# EAGLE design gsm_LoRa_due (EAGLE 9.6.2)
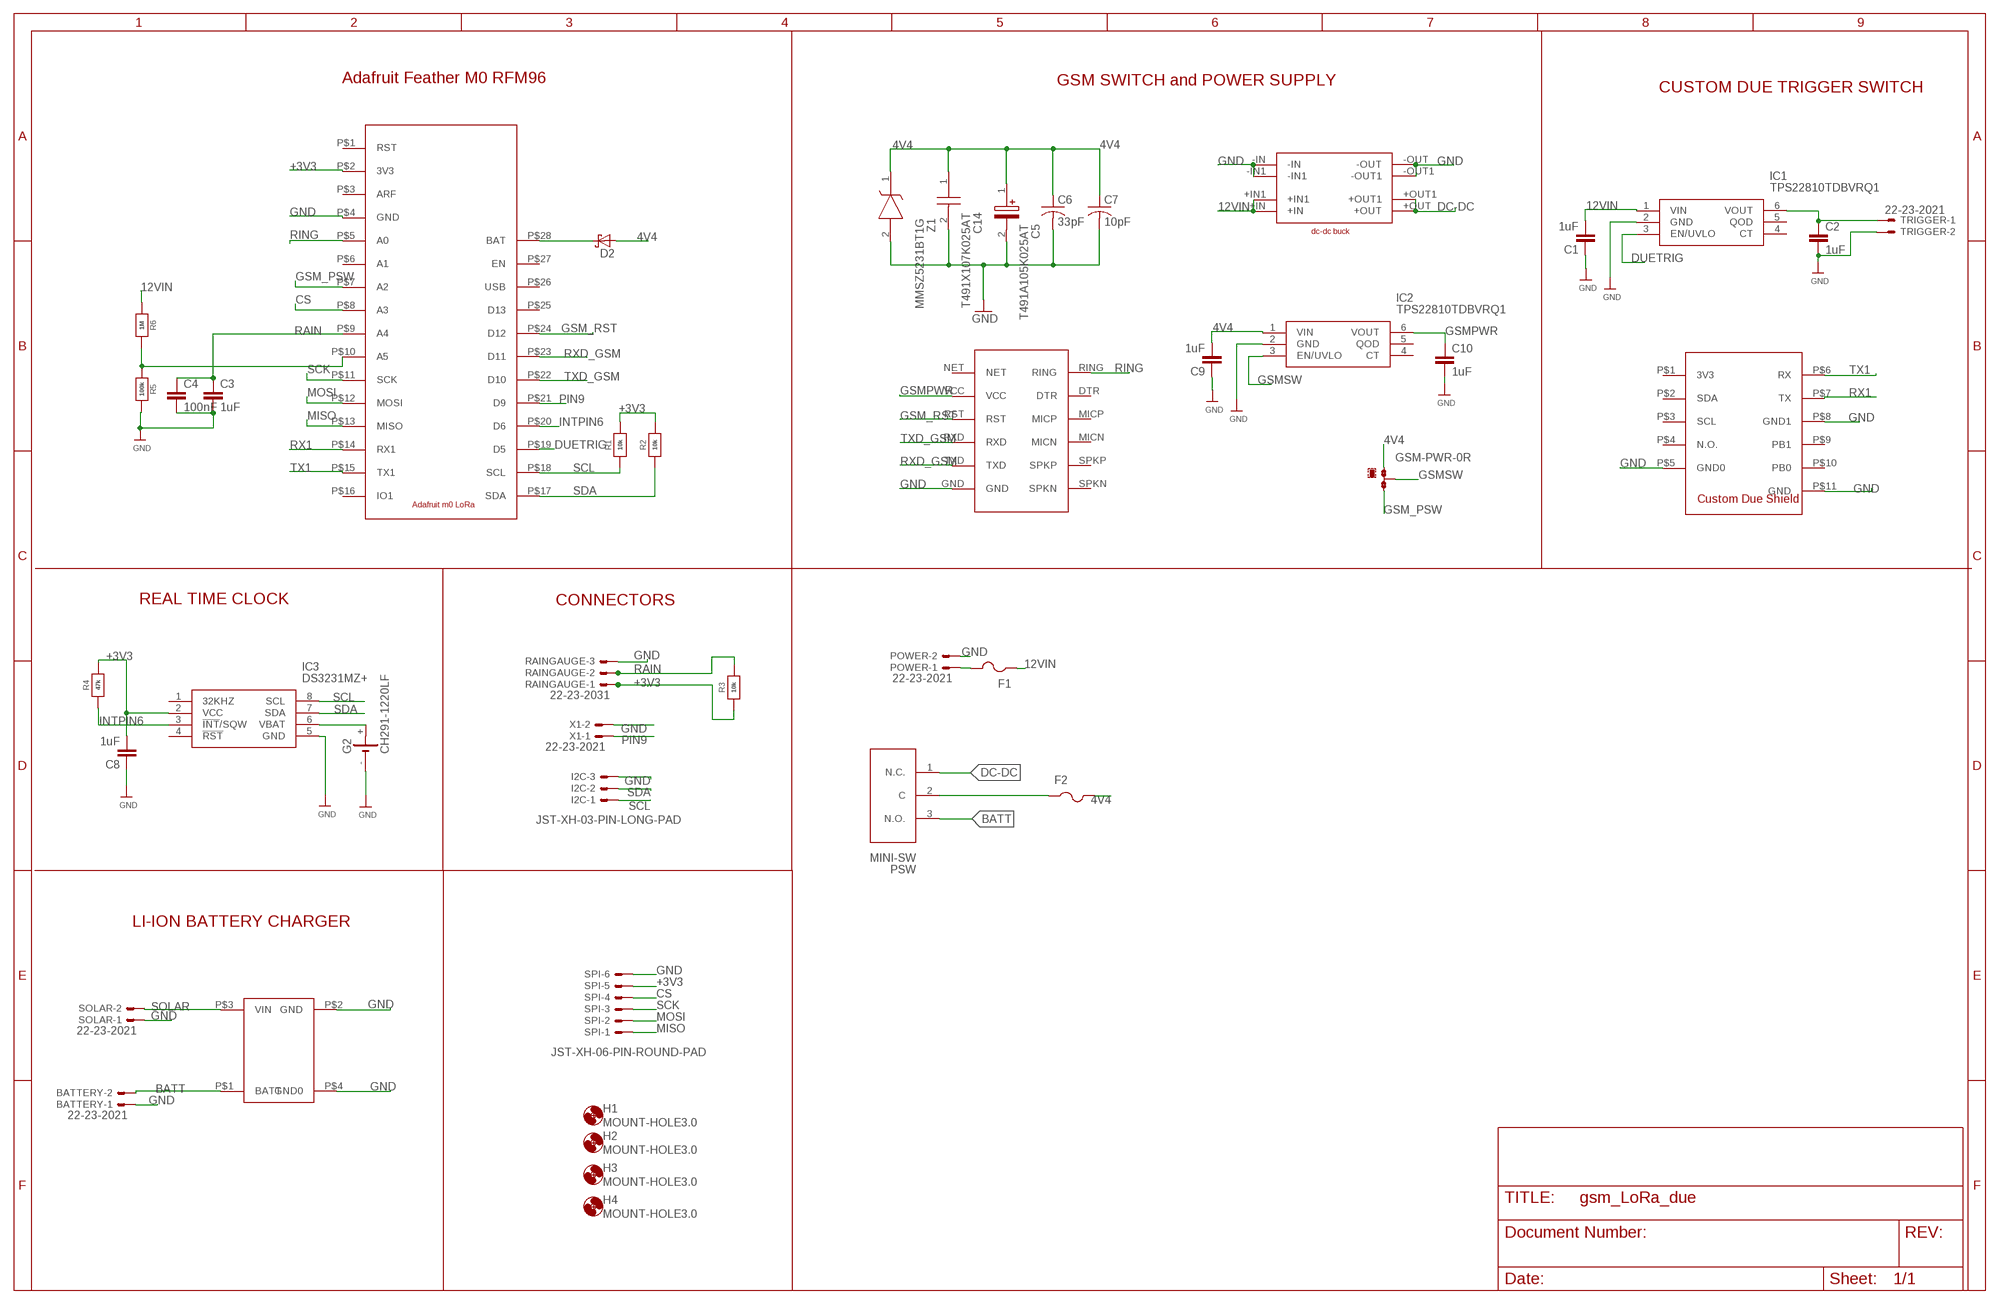
[diagram p0: schematic, sheet 1]

## Parts
BATTERY  22-23-2021  [22-23-2021]
C1  1uF  CC0603  [C0603]
C2  1uF  CC0603  [C0603]
C3  1uF  CC0603  [C0603]
C4  100nF  CC0603  [C0603]
C5  T491A105K025AT  [CAPPM3216X180N]
C6  33pF  C-USC0603  [C0603]
C7  10pF  C-USC0603  [C0603]
C8  1uF  CC0603  [C0603]
C9  1uF  CC0603  [C0603]
C10  1uF  CC0603  [C0603]
C14  T491X107K025AT  [CAPPM7343X430N]
D2  SCHOTTKY-DIODE  [DIODE_SMB]
F1  PTCFUSE-1206  [R1206]
F2  PTCFUSE-1206  [R1206]
G2  CH291-1220LF  [CH291-1220LF]
GSM-PWR  0R-JUMPB  [B0R-JMP]
H1  MOUNT-HOLE3.0  [3,0]
H2  MOUNT-HOLE3.0  [3,0]
H3  MOUNT-HOLE3.0  [3,0]
H4  MOUNT-HOLE3.0  [3,0]
I2C  JST-XH-03-PIN-LONG-PAD  [JST-XH-03-PACKAGE-LONG-PAD]
IC1  TPS22810TDBVRQ1  [SOT95P280X145-6N]
IC2  TPS22810TDBVRQ1  [SOT95P280X145-6N]
IC3  DS3231MZ+  [SOIC127P600X175-8N]
POWER  22-23-2021  [22-23-2021]
PSW  MINI-SW  [MINI-SW]
R1  10k  RESISTOR_0603_NOOUT  [0603-NO]
R2  10k  RESISTOR_0603_NOOUT  [0603-NO]
R3  10k  RESISTOR_0603_NOOUT  [0603-NO]
R4  47k  RESISTOR_0603_NOOUT  [0603-NO]
R5  100k  RESISTOR_0603_NOOUT  [0603-NO]
R6  1M  RESISTOR_0603_NOOUT  [0603-NO]
RAINGAUGE  22-23-2031  [22-23-2031]
SOLAR  22-23-2021  [22-23-2021]
SPI  JST-XH-06-PIN-ROUND-PAD  [JST-XH-06-PACKAGE-ROUND-PAD]
TRIGGER  22-23-2021  [22-23-2021]
U$1  M0_LORA  [RFM69]
U$8  DUE_PADSDUE_GSM  [DUESHIELD_BIG]
U$9  SIM800L_MODULE  [SIM800L]
U$10  DC-DC_BUCK_MAD  [DC-DC_BUCK]
U$11  LI-ION-CHARGER  [LI-ION]
X1  22-23-2021  [22-23-2021]
Z1  MMSZ5231BT1G  [SOD3716X135N]

## Nets
4V4: C5.1(+) C6.1 C7.1 C9.2 C14.1 D2.A(C) F2.2 GSM-PWR.1 IC2.1(VIN) Z1.1(K)
12VIN: C1.2 F1.1 IC1.1(VIN) R6.1 U$10.+IN U$10.+IN1
+3V3: C8.2 IC3.2(VCC) R1.2 R2.2 R3.1 R4.2 RAINGAUGE.1 SPI.5 U$1.P$2(3V3)
BATT: BATTERY.2 PSW.3(N.O.) U$11.P$1(BATT)
CS: SPI.4 U$1.P$8(A3)
DC-DC: PSW.1(N.C.) U$10.+OUT U$10.+OUT1
DUETRIG: IC1.3(EN/UVLO) U$1.P$19(D5)
GND: BATTERY.1 C1.1 C2.2 C3.2 C4.2 C5.2(-) C6.2 C7.2 C8.1 C9.1 C10.2 C14.2 G2.- I2C.3 IC1.2(GND) IC2.2(GND) IC3.5(GND) POWER.2 R5.2 RAINGAUGE.3 SOLAR.1 SPI.6 TRIGGER.2 U$1.P$4(GND) U$8.P$5(GND0) U$8.P$8(GND1) U$8.P$11(GND) U$9.GND U$10.-IN U$10.-IN1 U$10.-OUT U$10.-OUT1 U$11.P$2(GND) U$11.P$4(GND0) X1.2 Z1.2(A)
GSM_PSW: GSM-PWR.3 U$1.P$7(A2)
GSM_RST: U$1.P$24(D12) U$9.RST
GSMPWR: C10.1 IC2.6(VOUT) U$9.VCC
GSMSW: GSM-PWR.2 IC2.3(EN/UVLO)
INTPIN6: IC3.3(!INT!/SQW) R4.1 U$1.P$20(D6)
MISO: SPI.1 U$1.P$13(MISO)
MOSI: SPI.2 U$1.P$12(MOSI)
N$1: D2.C(A) U$1.P$28(BAT)
N$2: G2.+ IC3.6(VBAT)
N$4: F1.2 POWER.1
N$5: R5.1 R6.2 U$1.P$10(A5)
N$6: F2.1 PSW.2(C)
N$8: C2.1 IC1.6(VOUT) TRIGGER.1
PIN9: U$1.P$21(D9) X1.1
RAIN: C3.1 C4.1 R3.2 RAINGAUGE.2 U$1.P$9(A4)
RING: U$1.P$5(A0) U$9.RING
RX1: U$1.P$14(RX1) U$8.P$7(TX)
RXD_GSM: U$1.P$23(D11) U$9.TXD
SCK: SPI.3 U$1.P$11(SCK)
SCL: I2C.1 IC3.8(SCL) R1.1 U$1.P$18(SCL)
SDA: I2C.2 IC3.7(SDA) R2.1 U$1.P$17(SDA)
SOLAR: SOLAR.2 U$11.P$3(VIN)
TX1: U$1.P$15(TX1) U$8.P$6(RX)
TXD_GSM: U$1.P$22(D10) U$9.RXD
Unconnected: IC1.4(CT) IC1.5(QOD) IC2.4(CT) IC2.5(QOD) IC3.1(32KHZ) IC3.4(!RST) U$1.P$1(RST) U$1.P$3(ARF) U$1.P$6(A1) U$1.P$16(IO1) U$1.P$25(D13) U$1.P$26(USB) U$1.P$27(EN) U$8.P$1(3V3) U$8.P$2(SDA) U$8.P$3(SCL) U$8.P$4(N.O.) U$8.P$9(PB1) U$8.P$10(PB0) U$9.DTR U$9.MICN U$9.MICP U$9.NET U$9.SPKN U$9.SPKP

## Notes on the sheet
- Adafruit Feather M0 RFM96 | GSM SWITCH and POWER SUPPLY
- CUSTOM DUE TRIGGER SWITCH
- REAL TIME CLOCK | CONNECTORS
- LI-ION BATTERY CHARGER

## Library data of the parts
BATTERY POWER SOLAR TRIGGER X1 = con-molex:22-23-2021: .100" (2.54mm) Center Header - 2 Pin; MF: MOLEX; MPN: 22-23-2021; OC_FARNELL: 1462926; OC_NEWARK: 25C3832
C1-C4 C8-C10 = eagle-ltspice:C: CAPACITOR, European symbol; SPICEMODEL: NONE; SPICEPREFIX: C
C5 = SamacSys_Parts:T491A105K025AT: Cap Tant Solid 1uF 25V A CASE 10% (3.2 X 1.6 X 1.6mm) SMD 3216-18 8 Ohm 125C Automotive T/R Source: Datasheet <http://uk.rs-online.com/web/p/products/8685769>; ALLIED_NUMBER: 70097127; DESCRIPTION: Cap Tant Solid 1uF 25V A CASE 10% (3.2 X 1.6 X 1.6mm) SMD 3216-18 8 Ohm 125C Automotive T/R; HEIGHT: 1.8mm; MANUFACTURER_NAME: Kemet; MANUFACTURER_PART_NUMBER: T491A105K025AT; RS_PART_NUMBER: 8685769; RS_PRICE-STOCK: http://uk.rs-online.com/web/p/products/8685769
C6 C7 = rcl:C-US: CAPACITOR, American symbol; SPICEPREFIX: C
C14 = T491X107K025AT:T491X107K025AT: Capacitor Tantalum T491 Case X 25V 100uF Kemet ??10% 100??F 25 V dc SMD Tantalum Electrolytic Capacitor, X ESR 300m?? +125??C T491 Source: Datasheet <http://uk.rs-online.com/web/p/products/8015511P>; DESCRIPTION: Capacitor Tantalum T491 Case X 25V 100uF Kemet ??10% 100??F 25 V dc SMD Tantalum Electrolytic Capacitor, X ESR 300m?? +125??C T491; HEIGHT: 4.3mm; MANUFACTURER_NAME: Kemet; MANUFACTURER_PART_NUMBER: T491X107K025AT; RS_PART_NUMBER: 8015511P; RS_PRICE-STOCK: http://uk.rs-online.com/web/p/products/8015511P
D2 = eagle-ltspice:SCHOTTKY-DIODE: Schottky Diode; SPICEMODEL: NONE; SPICEPREFIX: D; SPICETYPE: diode
F1 F2 = adafruit:PTCFUSE: PTC fuses, resettable thermistors
G2 = battery:CH291-1220LF: Battery Holder, SMT, 12mm multicomp PART NO. CH291-1220LF Source: Data sheet <http://www.farnell.com/datasheets/1505860.pdf>
GSM-PWR = jump-0r-smd:0R-JUMP: SMD 0R 0805 Jumper
H1-H4 = holes:MOUNT-HOLE: MOUNTING HOLE with drill center marker
I2C = Rembrandt Electronics - JST XH Connectors v1-0:JST-XH-03-PIN: JST XH Connector 2 Pin Wire to board connector. Pitch: 2,54 mm, (0.100") Number of pins: 3 Created by Rembrandt Electronics www.rembrandtelectronics.com
IC1 IC2 = TPS22810TDBVRQ1:TPS22810TDBVRQ1: Automotive 18V, 2A, 79m Load Switch With Adjustable Rise Time and Adjustable Quick Output Discharge Source: Datasheet <http://www.ti.com/lit/gpn/tps22810-q1>; DESCRIPTION: Automotive 18V, 2A, 79m Load Switch With Adjustable Rise Time and Adjustable Quick Output Discharge; HEIGHT: 1.45mm; MANUFACTURER_NAME: Texas Instruments; MANUFACTURER_PART_NUMBER: TPS22810TDBVRQ1
IC3 = DS3231MZ+:DS3231MZ+: Real Time Clock 5+/-ppm RTC Source: Datasheet <http://uk.rs-online.com/web/p/products/1897249>; DESCRIPTION: Real Time Clock 5+/-ppm RTC; HEIGHT: 1.75mm; MANUFACTURER_NAME: Maxim Integrated; MANUFACTURER_PART_NUMBER: DS3231MZ+; RS_PART_NUMBER: 1897249; RS_PRICE-STOCK: http://uk.rs-online.com/web/p/products/1897249
PSW = slide_switch:MINI-SW
R1-R6 = microbuilder:RESISTOR: Resistors For new designs, use the packages preceded by an '_' character since they are more reliable: The following footprints should be used on most boards: _0402 - Standard footprint for regular board layouts _0603 - Standard footprint for regular board layouts _0805 - Standard footprint for regular board layouts _1206 - Standard footprint for regular board layouts For extremely tight-pitch boards where space is at a premium, the following 'micro-pitch' footprints can be used (smaller pads, no silkscreen outline, etc.): _0402MP - Micro-pitch footprint for very dense/compact boards _0603MP - Micro-pitch footprint for very dense/compact boards _0805MP - Micro-pitch footprint for very dense/compact boards _1206MP - Micro-pitch footprint for very dense/compact boards
RAINGAUGE = con-molex:22-23-2031: .100" (2.54mm) Center Header - 3 Pin; MF: MOLEX; MPN: 22-23-2031; OC_FARNELL: 1462950; OC_NEWARK: 30C0862
SPI = Rembrandt Electronics - JST XH Connectors v1-0:JST-XH-06-PIN: JST XH Connector 2 Pin Wire to board connector. Pitch: 2,54 mm, (0.100") Number of pins: 6 Created by Rembrandt Electronics www.rembrandtelectronics.com
U$1 = m0_LoRa:M0_LORA
U$8 = due_shield_pad:DUE_PADS
U$9 = sim800L_module:SIM800L_MODULE
U$10 = dc-dc_mad:DC-DC_BUCK_MAD
U$11 = LI-ION-CHARGER:LI-ION-CHARGER
Z1 = SamacSys_Parts:MMSZ5231BT1G: 5.1V Zener diode,MMSZ5231B 500mW ON Semiconductor MMSZ5231BT1G Zener Diode, 5.1V 5% 0.5 W SMT 2-Pin SOD-123 Source: Datasheet <http://uk.rs-online.com/web/p/products/5453049P>; ALLIED_NUMBER: 70099546; DESCRIPTION: 5.1V Zener diode,MMSZ5231B 500mW ON Semiconductor MMSZ5231BT1G Zener Diode, 5.1V 5% 0.5 W SMT 2-Pin SOD-123; HEIGHT: 1.35mm; MANUFACTURER_NAME: ON Semiconductor; MANUFACTURER_PART_NUMBER: MMSZ5231BT1G; RS_PART_NUMBER: 5453049P

## Board
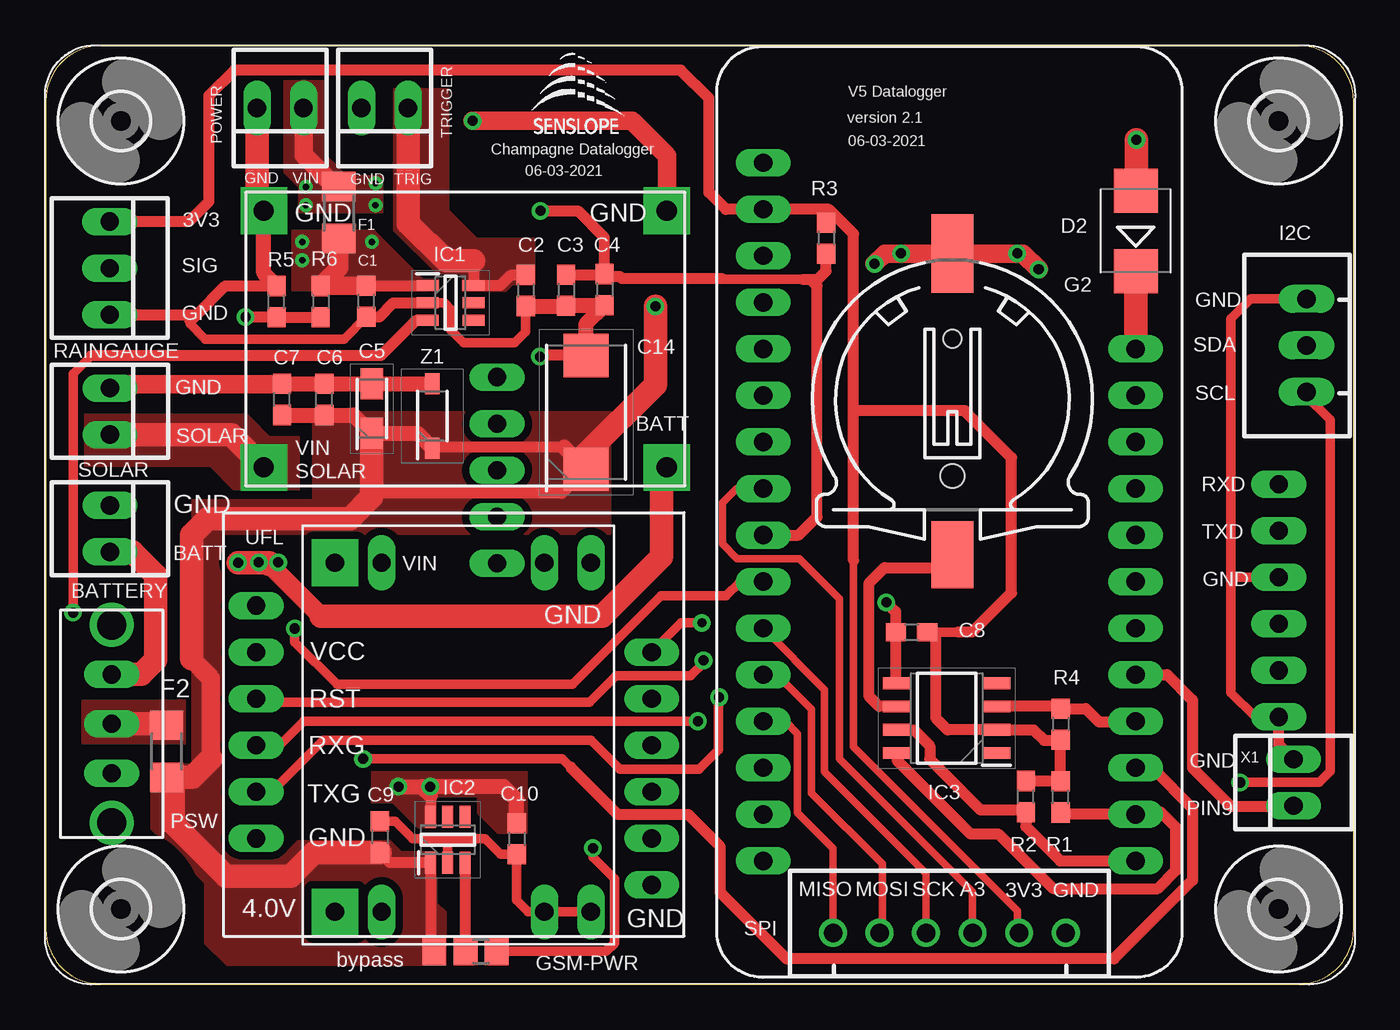
[diagram p1: board, top side]
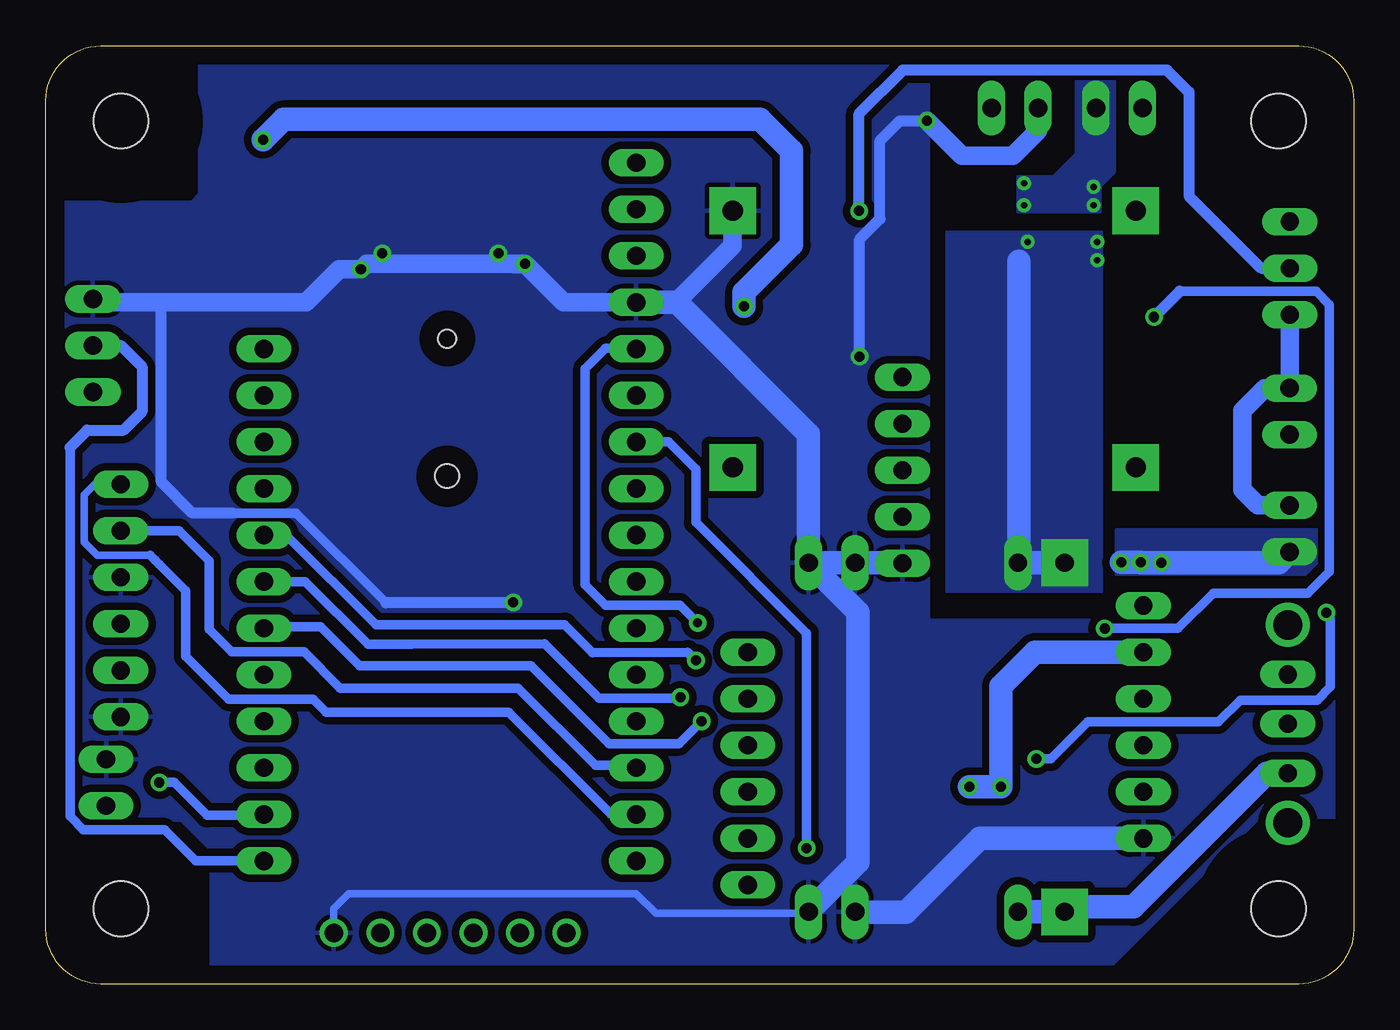
[diagram p2: board, bottom side, seen from below]

Size 71.4 x 51.2 mm. Coordinates in mm from the lower left corner, seen from the top.
Outline: 68.4,51.2 3,51.2 arc90 0,48.2 0,3 arc90 3,0 68.4,0 arc90 71.4,3 71.4,48.2 arc90 68.4,51.2
Copper layers (1*16): Top 0.035mm / dielectric 1.5mm / Bottom 0.035mm
Design rules "default": minimum track width 6mil, minimum drill 0.35mm, track to track 6mil, track to pad 6mil, pad to pad 6mil, via to via 6mil, smd to smd 6mil, copper to edge 40mil, drill to drill 6mil, minimum pad ring 10mil, minimum via ring 8mil, stop-mask expansion 4mil, vias tented up to drill 0mil, thermal gap 10mil

### Footprints (pad centres in the part's own frame; a part is rotated, then mirrored left to right if it is on the bottom)
22-23-2021 = drill 1 long: 1 -1.27,0; 2 1.27,0
C0603 = smd 1.1 x 1: 1 -0.85,0; 2 0.85,0
CAPPM3216X180N = smd 1.7 x 1.25: 1 -1.35,0; 2 1.35,0
CAPPM7343X430N = smd 2.35 x 2.45: 1 -3.1,0; 2 3.1,0
DIODE_SMB = smd 2.4 x 2.4: A 2.2,0; C -2.2,0
R1206 = smd 1.6 x 1.803: 1 -1.422,0; 2 1.422,0
CH291-1220LF = smd 2.3 x 3.66: + 0,-2.296 | smd 2.3 x 4.3: - 0,14.146 | hole 1.3: 0,2 | hole 1: 0,9.5
B0R-JMP = smd 1.5 x 1.3: 1 0,1.7; 2 0,0; 3 0,-1.7
3,0 = hole 3: 0,0
JST-XH-03-PACKAGE-LONG-PAD = drill 1.016 long: 1 -2.54,0; 2 0,0; 3 2.54,0
SOT95P280X145-6N = smd 1.2 x 0.6: 1 -1.25,0.95; 2 -1.25,0; 3 -1.25,-0.95; 4 1.25,-0.95; 5 1.25,0; 6 1.25,0.95
SOIC127P600X175-8N = smd 1.525 x 0.65: 1 -2.712,1.905; 2 -2.712,0.635; 3 -2.712,-0.635; 4 -2.712,-1.905; 5 2.712,-1.905; 6 2.712,-0.635; 7 2.712,0.635; 8 2.712,1.905
MINI-SW = drill 1 long: 1 0,0; 2 2.7,0; 3 5.4,0 | drill 1.6: 4 -2.7,0; 5 8.1,0
0603-NO = smd 1.1 x 1: 1 -0.85,0; 2 0.85,0
22-23-2031 = drill 1 long: 1 -2.54,0; 2 0,0; 3 2.54,0
JST-XH-06-PACKAGE-ROUND-PAD = drill 1.016: 1 -6.35,0; 2 -3.81,0; 3 -1.27,0; 4 1.27,0; 5 3.81,0; 6 6.35,0
RFM69 = drill 1 long: P$1 -10.16,21.59; P$2 -10.16,19.05; P$3 -10.16,16.51; P$4 -10.16,13.97; P$5 -10.16,11.43; P$6 -10.16,8.89; P$7 -10.16,6.35; P$8 -10.16,3.81; P$9 -10.16,1.27; P$10 -10.16,-1.27; P$11 -10.16,-3.81; P$12 -10.16,-6.35; P$13 -10.16,-8.89; P$14 -10.16,-11.43; P$15 -10.16,-13.97; P$16 -10.16,-16.51; P$17 10.16,-16.51; P$18 10.16,-13.97; P$19 10.16,-11.43; P$20 10.16,-8.89; P$21 10.16,-6.35; P$22 10.16,-3.81; P$23 10.16,-1.27; P$24 10.16,1.27; P$25 10.16,3.81; P$26 10.16,6.35; P$27 10.16,8.89; P$28 10.16,11.43
DUESHIELD_BIG = drill 1 long: P$1 -21.082,8.89; P$2 -21.082,6.35; P$3 -21.082,3.81; P$4 -21.082,1.27; P$5 -21.082,-1.27; P$6 21.59,3.048; P$7 21.59,0.508; P$8 21.59,-2.032; P$9 21.59,-4.572; P$10 21.59,-7.112; P$11 21.59,-9.652
SIM800L = drill 1 long: DTR 11.176,1.27; GND -10.414,-6.35; MICN 11.176,-3.81; MICP 11.176,-1.27; NET -10.414,6.35; RING 11.176,3.81; RST -10.414,1.27; RXD -10.414,-1.27; SPKN 11.176,-8.89; SPKP 11.176,-6.35; TXD -10.414,-3.81; VCC -10.414,3.81
DC-DC_BUCK = drill 1 pad 2.54 square: +IN 7.112,-8.89; +OUT 7.112,10.16 | drill 1 long: +IN1 4.572,-8.89; +OUT1 4.572,10.16; -IN -6.858,-8.89; -IN1 -4.318,-8.89; -OUT -6.858,10.16; -OUT1 -4.318,10.16
LI-ION = drill 1.1 pad 2.54 square: P$1 0,0; P$2 14,0; P$3 0,22; P$4 14,22
SOD3716X135N = smd 1.15 x 0.8: 1 -1.75,0; 2 1.75,0

### Placement (x,y rotation side)
BATTERY  3.5,24.85 270 top
C1  17.5,37.26 90 top
C2  26.2,37.85 270 top
C3  28.4,37.86 270 top
C4  30.5,37.9 270 top
C5  17.8,31.4 90 top
C6  15.2,31.9 90 top
C7  12.9,31.9 90 top
C8  47.27,19.2 0 top
C9  18.24,8.02 270 top
C10  25.7,7.92 270 top
C14  29.5,31.2 90 top
D2  59.5,41.1 90 top
F1  16,42.1 90 top
F2  6.6,12.7 270 top
G2  49.49,25.72 0 top
GSM-PWR  22.91,1.78 90 top
H1  67.3,4.1 0 top
H2  67.3,47.1 0 top
H3  4.1,4.1 0 top
H4  4.1,47.1 0 top
I2C  68.83,34.85 90 top
IC1  22.09,37.17 0 top
IC2  21.95,7.87 90 top
IC3  49.19,14.51 180 top
POWER  12.8,47.8 180 top
PSW  3.6,11.5 90 top
R1  55.4,10.21 90 top
R2  53.5,10.23 90 top
R3  42.6,40.7 270 top
R4  55.4,14.18 270 top
R5  12.6,37.24 90 top
R6  15,37.24 270 top
RAINGAUGE  3.49,39.07 270 top
SOLAR  3.5,31.25 270 top
SPI  49.33,2.79 0 top
TRIGGER  18.5,47.8 180 top
U$1  49.33,23.23 0 top
U$8  45.72,24.23 0 top
U$9  21.9,14.3 0 top
U$10  22.9,14.1 180 top
U$11  33.9,28.2 90 top
U$13  [LOGO_SML_TNAME]  28.83,48.02 0 top
X1  68.11,11 90 top
Z1  21.1,31 90 top

### Tracks (layer width: path | path; a pad name or v marks a point on that pad's centre or on a via)
4V4  (via drill 0.55)
  Top 0.61: Z1.1 21.15,29.3 28.3,29.3 | GSM-PWR.1 21,1.99 IC2.1 18.79,6.62 C9.2 | C14.1 28.17,26.77 17.98,26.77 17.8,26.59
  Top 0.813: 28.3,29.3 C14.1 | C7.1 C6.1 16.8,31.05 C5.1 20.3,30.05 Z1.1
  Top 1.016: 7.96,17.74 9,16.7 9,12.3
  Top 1.27: C5.1 17.8,26.59 16.61,25.4 8.84,25.4 7.96,24.52 7.96,17.74 | C14.1 29.5,28.94 33.27,32.71 v33.27,36.98 | v59.54,46.07 59.54,43.34 D2.A | C9.2 14.64,7.17 13.36,5.89 9.86,5.89 6.96,8.79 6.96,11.28 F2.2 7.98,11.28 9,12.3
  Bottom 1.27: v33.27,36.98 33.27,37.74 30.68,40.33 30.68,45.46 32.41,47.19 58.42,47.19 v59.54,46.07
  pour Top (isolate 0.406, no thermals): 21.34,7.21 21.34,4.42 21.84,3.91 21.84,1.01 9.91,1.01 8.69,2.23 8.69,5.54 5.74,8.48 5.74,12.01 7.99,12.01 7.99,26.41 14.53,26.41 14.58,26.47 14.58,31.24 30.84,31.24 30.84,24.53 9.64,24.53 9.64,7.63 10.46,6.81 12.75,6.81 13.77,7.82 18.8,7.82 19.41,7.21
12VIN  (via drill 0.35)
  Top 0.61: C1.2 IC1.1
  Top 1.016: C1.2 15.02,38.11 R6.1 16,39.09 F1.1
  Bottom 1.27: U$10.+IN U$10.+IN1 18.29,23.03 18.29,39.45 18.27,39.44
  other vias: 17.8,40.5 14,40.5 14,39.5
  pour Top (no thermals): 21.44,37.84 13.46,37.84 13.46,41.13 17.94,41.13 17.94,41.09 20.57,38.45 21.44,38.45
  pour Bottom (isolate 0.406, no thermals): 13.72,41.07 13.72,21.39 22.25,21.39 22.25,41.07
+3V3
  Top 0.406: SPI.5 53.03,2.89 53.03,4.01 44.09,12.95 44.09,23.11
  Top 0.508: 49.8,19.2 C8.2
  Top 0.61: R2.2 55.38,11.08 R1.2 R4.2 55.37,13.3 54.5,13.3 53.92,13.88 IC3.2 49.22,13.88 48.6,14.5 48.6,19.2 C8.2 | 49.8,19.2 50.57,19.2 52.72,21.35 52.72,28.73 50.16,31.29 44.09,31.29 | RAINGAUGE.1 7.81,41.61 8.9,42.7 8.9,48.48 10.3,49.88 34.66,49.88 36.2,48.34 36.2,43.2 37.12,42.28 U$1.P$2 42.76,42.28 | 44.09,23.11 44.09,31.29 | 44.09,31.29 44.09,40.94 42.76,42.28 | R3.1 42.6,42.12 42.76,42.28
BATT  (via drill 0.55)
  Top 1.016: 15.04,20.06 12.2,22.9
  Top 1.27: 3.6,23.48 BATTERY.2 4.72,23.58 6,22.3 6,17.7 5.2,16.9 PSW.3 | U$11.P$1 33.6,27.9 33.6,23.31 30.35,20.06 15.04,20.06 | 12.2,22.9 12.2,23 v10.5,23
  Bottom 1.27: BATTERY.2 4.08,23 v10.5,23 11.62,23 v11.63,23.01 v12.69,23.01
  pour Bottom (no thermals): 2.08,24.84 12.95,24.84 13,24.79 13,22.3 2.64,22.3 1.98,22.96 1.98,24.84
CS
  Top 0.406: U$1.P$8 37.71,27.04 36.93,26.26 36.93,24.03 37.74,23.21 41.15,23.21 43.33,21.03 43.33,12.29 50.6,5.03 SPI.4
DC-DC
  Bottom 1.27: U$10.+OUT1 U$10.+OUT 15.51,4.21 12.03,4.21 4.75,11.5 PSW.1
DUETRIG  (via drill 0.55)
  Top 0.508: 28.65,11.83 28.19,12.29 v17.32,12.29 | 2.5,34.3 1.5,33.3 v1.5,20.27
  Top 0.61: U$1.P$19 60.4,11.8 62.6,9.6 62.6,5.66 58.31,1.37 40.44,1.37 36.83,4.98 36.83,7.49 35.08,9.24 31.24,9.24 28.65,11.83 | 2.5,34.3 18.3,34.3 20.22,36.22 IC1.3
  Bottom 0.508: v17.32,12.29 16.52,12.29 14.52,14.3 7.4,14.3 6.2,15.5 2,15.5 1.27,16.23 1.27,19.99 1.5,20.22 v1.5,20.27
GND  (via drill 0.55)
  Top 0.508: U$8.P$11 66.02,14.58 64.7,15.9 64.7,22 | U$8.P$8 64.9,22.2 64.7,22 | I2C.3 65.79,37.39 64.7,36.3 64.7,22 | IC1.2 21.73,37.17 22.1,36.8 22.1,35.7 22.8,35 25.6,35 26.2,35.6 C2.2 | C1.1 16.29,35.2 8.7,35.2 7.87,36.03 7.87,36.17 | U$10.-OUT U$10.-OUT1 26.34,3.94 25.7,4.57 C10.2 24.83,7.07 23.98,7.92 21.95,7.92 | C9.1 19.06,8.88 20.02,7.92 21.95,7.92 | IC2.2 21.95,7.92
  Top 0.61: IC3.5 46.41,16.48 C8.1 46.39,19.22 46.39,20.32 v45.88,20.83 | X1.2 67.31,13.07 U$8.P$11 | C1.1 18.21,36.41 18.97,37.17 IC1.2 | C3.2 | C4.2 30.46,37.01 | RAINGAUGE.3 8.23,36.53 | 7.87,36.17 8.23,36.53 | 8.23,36.53 9.8,38.1 R5.2 | C14.2 27.04,34.3 v26.98,34.24
  Top 0.813: C7.2 C6.2 C5.2 Z1.2 | R5.2 11.9,38.79 U$11.P$4 | C2.2 C3.2 | 30.46,37.01 C3.2 | C14.2 29.5,36.05 C4.2
  Top 1.016: C7.2 12.88,32.73 3.7,32.73 SOLAR.1 | v54.2,39 53.33,39.87 G2.- 45.81,39.87 v45.25,39.3 | U$11.P$2 33.9,45.2 32,47.1 v23.3,47.1
  Top 1.27: POWER.2 11.53,42.57 U$11.P$4
  Bottom 0.406: SPI.6 55.68,4.11 54.86,4.93 39.17,4.93 38.1,3.86 29.84,3.86 U$10.-OUT
  Bottom 0.508: 52.83,20.79 57.73,25.7 61.2,25.7
  Bottom 0.61: v45.88,20.83 45.91,20.79 52.83,20.79 | 61.2,25.7 63.4,25.7 65.1,27.4 65.1,36.8 65.69,37.39 I2C.3 | v53.03,39.88 53.91,39 v54.2,39 | v46.69,39.88 45.91,39.1 45.45,39.1 v45.25,39.3 | v26.98,34.24 26.98,40.64 25.86,41.76 25.86,46.02 24.78,47.1 v23.3,47.1
  Bottom 1.016: RAINGAUGE.3 3.5,36.52 SOLAR.1 4.86,32.52 6.09,31.29 6.09,26.98 5.23,26.12 BATTERY.1 | U$11.P$2 33.9,40.3 37,37.2 U$1.P$4 43.14,37.2 v45.25,39.3 53.9,39.3 v54.2,39 55.4,39 57.2,37.2 68.64,37.2 I2C.3 | v23.3,47.1 21.4,45.2 18.6,45.2 17.23,46.57 TRIGGER.2
  Bottom 1.27: U$10.-IN U$10.-IN1 24.67,22.99 U$8.P$5 | U$9.GND 20.39,7.95 24.43,3.91 27.19,3.91 U$10.-OUT1 | U$10.-OUT 27.07,6.63 27.07,20.3 U$10.-IN | U$10.-IN 29.76,30.01 36.95,37.2 U$1.P$4
  pour Bottom (isolate 0.406): 1.17,19.91 23.11,19.91 23.16,19.96 23.16,50.9 62.33,50.9 63.04,50.19 63.04,43.13 63.45,42.72 70.41,42.72 70.41,8.99 70.51,8.89 64.01,8.89 62.43,7.31 62.43,0.61 62.59,0.46 13.72,0.46 5.13,9.04 0.86,9.04 0.76,9.14 0.76,19.91
GSM_PSW  (via drill 0.55)
  Top 0.508: v29.87,7.42 29.87,6.91 31.04,5.74 31.04,2.23 30.58,1.78 GSM-PWR.3
  Bottom 0.508: U$1.P$7 37.41,29.58 35.92,28.09 35.92,25.2 29.87,19.15 v29.87,7.42
GSM_RST  (via drill 0.55)
  Top 0.305: v35.9,17.66 35.98,17.59
  Top 0.508: 35.98,17.59 35.2,16.81 31.14,16.81 29.69,15.37 11.69,15.37 U$9.RST
  Bottom 0.508: v35.9,17.66 36.36,18.12 41.56,18.09 43.08,19.61 53.38,19.61 58.27,24.5 U$1.P$24
GSMPWR  (via drill 0.55)
  Top 0.61: 21,10.3 IC2.6
  Top 0.813: v19.25,10.77 20.52,10.77 21,10.3 | C10.1 25.7,10.06 24.99,10.77 v20.98,10.77
  Bottom 1.27: U$9.VCC 17.4,18.11 19.25,16.25 v19.25,10.77 v20.98,10.77
  pour Top (no thermals): 21.29,8.53 20.32,8.53 18.95,9.9 17.78,9.9 17.78,11.58 26.26,11.58 26.26,8.23 24.69,8.23 23.57,9.35 23.57,10.21 21.29,10.21
GSMSW
  Top 0.61: IC2.3 22.9,1.79 GSM-PWR.2
INTPIN6
  Top 0.61: IC3.3 55.28,15.15 R4.1 56.77,15.03 57.5,14.3 59.45,14.3 U$1.P$20
MISO
  Top 0.406: U$1.P$13 40.37,14.34 41.05,13.66 41.05,9.35 42.98,7.42 SPI.1
MOSI
  Top 0.406: SPI.2 45.67,2.95 45.67,6.55 41.81,10.41 41.81,14.98 39.91,16.88 U$1.P$12
N$1
  Top 1.27: D2.C U$1.P$28
N$2
  Top 0.61: IC3.6 45.49,15.15 44.94,15.69 44.94,21.88 45.79,22.73 49.5,22.73 G2.+
N$4  (via drill 0.35)
  Top 1.016: F1.2 15.8,43.52 14.07,45.25 POWER.1
  other vias: 14.2,43.5 14.2,42.5 18,42.5 18,43.7
  pour Top (no thermals): 13,49.3 13,44.3 13.8,43.5 13.8,42.1 18.4,42.1 18.4,44.1 16.4,44.1 15.2,45.3 15.2,49.3
  pour Bottom (no thermals): 13,49.3 13,44.3 13.8,43.5 13.8,42.1 18.4,42.1 18.4,44.1 16.4,44.1 15.2,45.3 15.2,49.3
N$5  (via drill 0.55)
  Top 0.508: v13.6,19.4 13.6,18.66 15.9,16.36 28.75,16.36 33.58,21.18 37.13,21.18 37.91,21.96 U$1.P$10
  Top 0.61: R6.2 R5.1 v10.91,36.39 v10.9,36.4
  Bottom 0.508: 9.49,37.81 2.05,37.81 1.32,37.08 1.32,22.51 2.5,21.33 7.67,21.33 9.6,19.4 v13.6,19.4
  Bottom 0.61: v10.9,36.4 9.49,37.81
N$6
  Top 1.27: F2.1 6.52,14.2 PSW.2
  pour Top (no thermals): 7.6,13.1 7.6,15.5 2,15.5 2,13.1
N$8
  Top 0.61: C2.1 25.4,38.7 24.82,38.12 IC1.6 23.34,39.46
  Top 1.27: TRIGGER.1 19.77,41.53 21.84,39.46 23.34,39.46
  pour Top (no thermals): 22.76,37.79 22.76,38.66 22.66,38.76 21.39,38.76 19,41.15 19,43.28 19,48.87 22,48.87 22,42.21 23.52,40.69 26.67,40.69 26.67,38.15 25.45,38.15 25.1,37.79
PIN9
  Top 0.61: U$1.P$21 61.22,16.88 62.6,15.5 62.6,11.8 64.7,9.7 68.08,9.7 X1.1
RAIN  (via drill 0.55)
  Top 0.508: 41.35,38.45 36.95,38.45 36.9,38.5
  Top 0.61: U$1.P$9 41.1,24.5 42.1,25.5 42.1,38.1 41.75,38.45 | 36.9,38.5 31.45,38.5 31.34,38.61 30.64,38.61 C4.1 | C3.1 30.46,38.71 C4.1 | C4.1 30.5,40.73 29.04,42.19 v27,42.19 | 41.35,38.45 41.75,38.45 | 41.75,38.45 42.15,38.45 42.6,38.9 R3.2
  Bottom 0.61: v27,42.19 27,47.5 24.62,49.88 10.2,49.88 9,48.68 9,43 5.07,39.07 RAINGAUGE.2
RING  (via drill 0.5 pad 0.95)
  Top 0.508: U$9.RING 34.67,19.71 v35.81,19.71
  Bottom 0.508: v35.81,19.71 36.78,20.67 40.84,20.67 41.96,21.79 41.96,33.58 40.84,34.7 39.2,34.7 U$1.P$5
RX1
  Bottom 0.508: U$1.P$14 39.31,11.94 41.4,11.94 45.62,16.15 55.32,16.15 57.3,18.13 61.27,18.13 62.48,19.35 62.48,23.11 64.11,24.74 U$8.P$7
RXD_GSM  (via drill 0.55)
  Top 0.508: v36.75,15.65 36.73,15.62 36.73,12.8 35.66,11.73 31.34,11.73 29.77,13.31 15.14,13.31 12.32,10.49 U$9.TXD
  Bottom 0.508: v36.75,15.65 36.8,15.6 41.2,15.6 44.16,18.56 51.41,18.54 53.81,18.54 57.23,21.96 U$1.P$23
SCK
  Top 0.406: SPI.3 48.06,6.04 42.52,11.58 42.52,16.07 U$1.P$11
SCL  (via drill 0.55)
  Top 0.508: v65.2,11 69.51,11 70.11,11.6 70.11,30.79 68.71,32.19 I2C.1
  Top 0.61: IC3.8 46.47,12.21 50.48,8.2 52,8.2 55,5.2 60.7,5.2 61.7,6.2 61.7,8.55 60.85,9.4 59.63,9.4 U$1.P$18 55.5,9.26 R1.1
  Bottom 0.508: U$1.P$18 59.55,9.2 62.6,9.2 64.4,11 v65.2,11
SDA
  Top 0.61: IC3.7 47.38,13.88 48.26,12.99 48.26,12.27 51.03,9.5 53.38,9.5 R2.1 53.5,8.6 55.38,6.72 U$1.P$17
  Bottom 0.508: U$1.P$17 63.21,6.72 64.91,8.42 69.35,8.42 70.08,9.15 70.08,29.28
  Bottom 0.61: 70.08,29.28 69.14,30.22 67.16,30.22 66.14,31.24 66.14,33.68 67.31,34.85 I2C.2
SOLAR
  Top 1.27: SOLAR.2 10.12,29.98 U$11.P$3
  pour Top (no thermals): 2.13,31.09 10.97,31.09 12.19,29.87 13.82,29.87 13.82,26.97 10.26,26.97 8.99,28.24 2.13,28.24
TX1
  Bottom 0.406: 65.7,23.4 68.6,23.4 69.3,24.1 69.3,26.7 68.72,27.28 U$8.P$6
  Bottom 0.508: 65.7,23.4 65.42,23.12 65.2,22.9 63.75,21.45 63.75,17.88 61.42,15.54 56.79,15.54 56.08,14.83 46.13,14.83 40.55,9.26 U$1.P$15
TXD_GSM  (via drill 0.55)
  Top 0.508: U$9.RXD 12.76,13.03 14.07,14.34 v35.6,14.34
  Bottom 0.508: v35.6,14.34 36.82,13.12 40.66,13.12 44.91,17.37 54.25,17.37 56.39,19.51 59.4,19.51 U$1.P$22

### Text on the board
tNames: V5 Datalogger | version 2.1 | 06-03-2021 | Champagne Datalogger | GND | VIN | GND | TRIG | 06-03-2021 | GND | GND | 3V3 | SIG | GND | GND | SDA | GND | SCL | BATT | SOLAR | VIN | SOLAR | RXD | GND | UFL | TXD | BATT | VIN | GND | GND | VCC | RST | RXG | GND | TXG | PIN9 | GND | MISO | MOSI | SCK | A3 | 3V3 | GND | 4.0V | GND | bypass